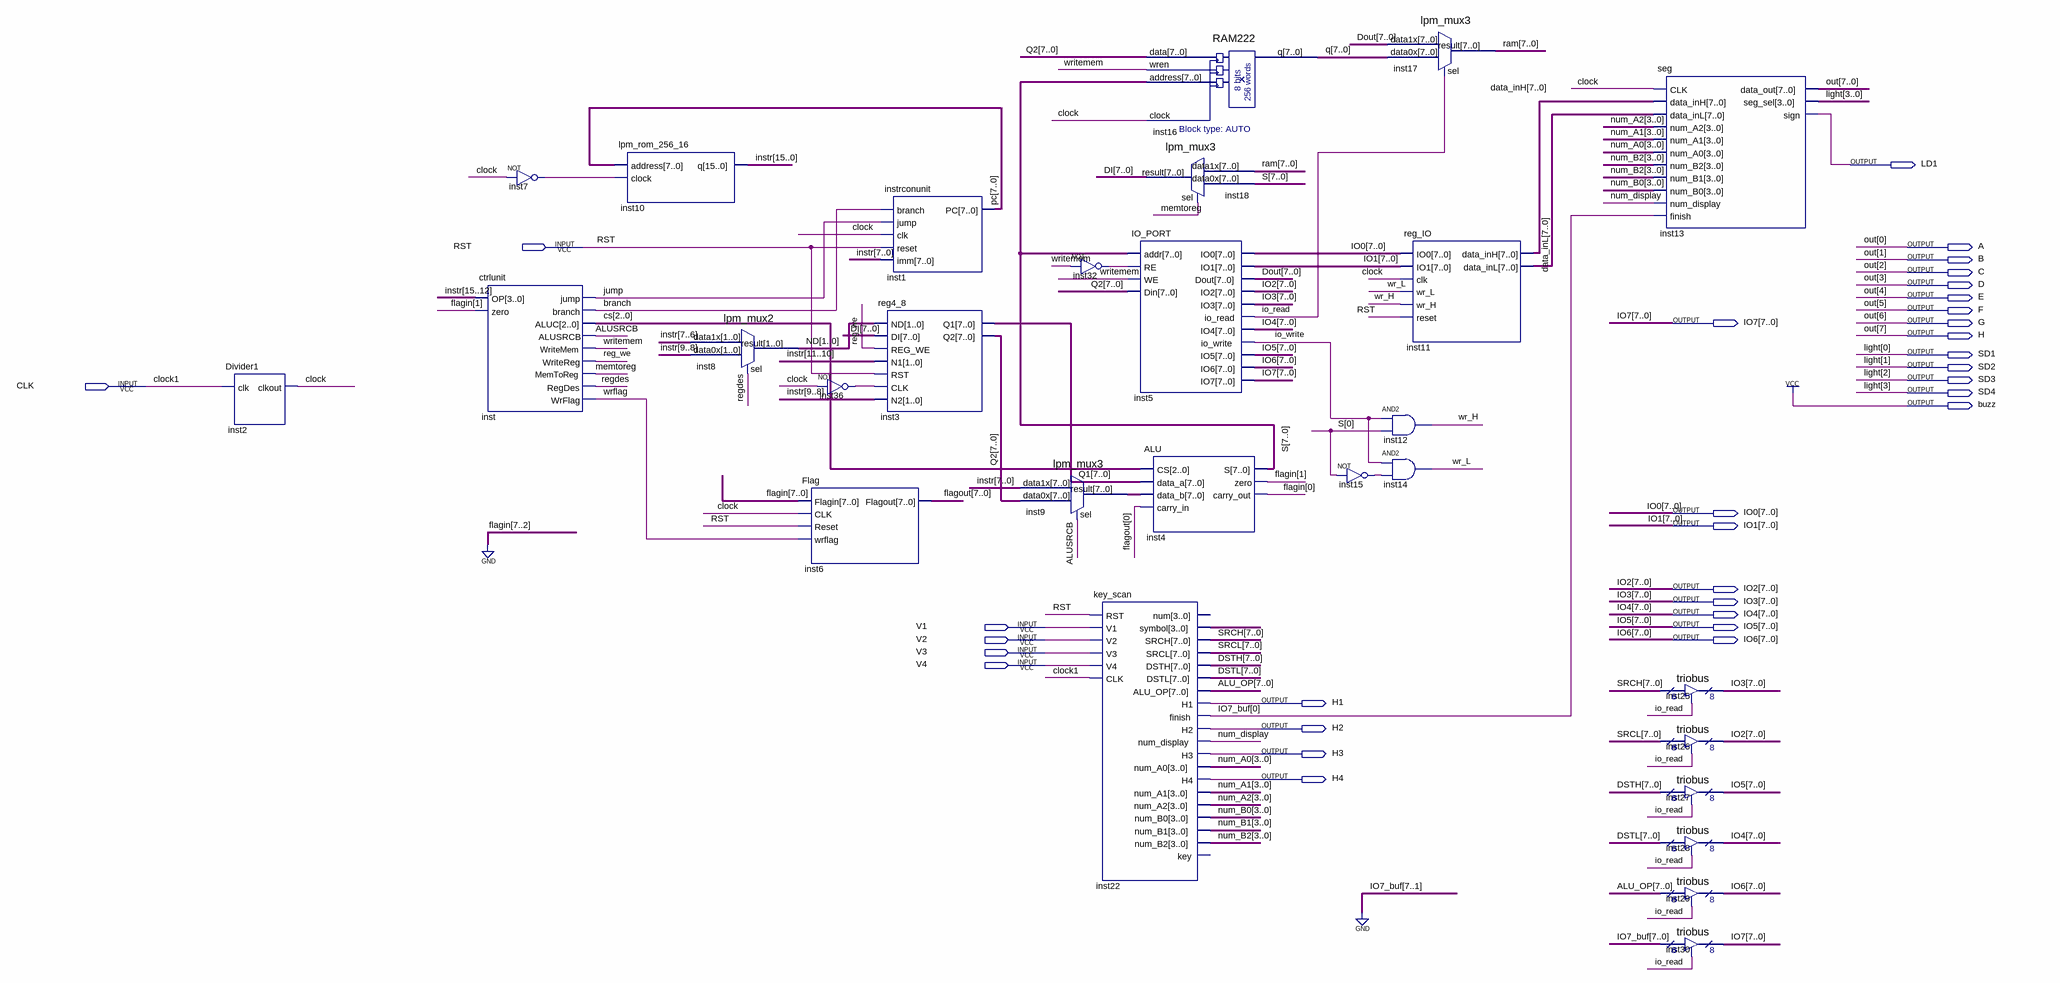
[diagram p0: schematic sheet]
// Quartus schematic systemC.bdf as structural Verilog: 28 symbols, 32 pins
module systemC (
  input  RST,
  input  CLK,
  input  V1,
  input  V2,
  input  V3,
  input  V4,
  output LD1,
  output A,
  output B,
  output C,
  output D,
  output E,
  output F,
  output [7:0] IO7,
  output G,
  output H,
  output SD1,
  output SD2,
  output SD3,
  output SD4,
  output buzz,
  output [7:0] IO0,
  output [7:0] IO1,
  output [7:0] IO2,
  output [7:0] IO3,
  output [7:0] IO4,
  output [7:0] IO5,
  output [7:0] IO6,
  output H1,
  output H2,
  output H3,
  output H4
);

  wire ALUSRCB, branch, clock, inst7_out, inst15_out, inst32_out, inst36_out, io_read, io_write, jump,
       memtoreg, num_display, reg_we, regdes, wr_H, wr_L, wrflag, writemem;
  wire [0:0] IO7_buf;
  wire [1:0] flagin, ND;
  wire [2:0] cs;
  wire [3:0] inst22_symbol, num_A0, num_A1, num_A2, num_B0, num_B1, num_B2;
  wire [7:0] ALU_OP, data_inH, data_inL, DI, Dout, DSTH, DSTL, flagout, inst9_result, pc, q, Q1, Q2, ram, S,
       SRCH, SRCL;
  wire [15:0] instr;

  Divider1 inst2 (.clk(CLK), .clkout(clock));
  not inst7 (inst7_out, clock);
  ctrlunit inst (
    .OP(instr[15:12]), .zero(flagin[1]), .jump(jump), .branch(branch), .ALUC(cs), .ALUSRCB(ALUSRCB),
    .WriteMem(writemem), .WriteReg(reg_we), .MemToReg(memtoreg), .RegDes(regdes), .WrFlag(wrflag));
  lpm_rom_256_16 inst10 (.address(pc), .clock(inst7_out), .q(instr));
  lpm_mux2 inst8 (.data1x(instr[7:6]), .data0x(instr[9:8]), .sel(regdes), .result(ND));
  not inst36 (inst36_out, clock);
  Flag inst6 (.Flagin({{6{1'b0}}, flagin}), .CLK(clock), .Reset(RST), .wrflag(wrflag), .Flagout(flagout));
  reg4_8 inst3 (
    .ND(ND), .DI(DI), .REG_WE(reg_we), .N1(instr[11:10]), .RST(RST), .CLK(inst36_out), .N2(instr[9:8]),
    .Q1(Q1), .Q2(Q2));
  instrconunit inst1 (.branch(branch), .jump(jump), .clk(clock), .reset(RST), .imm(instr[7:0]), .PC(pc));
  lpm_mux3 inst9 (.data1x(instr[7:0]), .data0x(Q2), .sel(ALUSRCB), .result(inst9_result));
  not inst32 (inst32_out, writemem);
  IO_PORT inst5 (
    .addr(S), .RE(inst32_out), .WE(writemem), .Din(Q2), .Dout(Dout), .io_read(io_read), .io_write(io_write),
    .IO0(IO0), .IO1(IO1), .IO2(IO2), .IO3(IO3), .IO4(IO4), .IO5(IO5), .IO6(IO6), .IO7(IO7));
  key_scan inst22 (
    .RST(RST), .V1(V1), .V2(V2), .V3(V3), .V4(V4), .CLK(CLK), .symbol(inst22_symbol), .SRCH(SRCH),
    .SRCL(SRCL), .DSTH(DSTH), .DSTL(DSTL), .ALU_OP(ALU_OP), .H1(H1), .finish(IO7_buf[0]), .H2(H2),
    .num_display(num_display), .H3(H3), .num_A0(num_A0), .H4(H4), .num_A1(num_A1), .num_A2(num_A2),
    .num_B0(num_B0), .num_B1(num_B1), .num_B2(num_B2));  // open: num, key
  RAM222 inst16 (.data(Q2), .wren(writemem), .address(S), .clock(clock), .q(q));
  lpm_mux3 inst18 (.data1x(ram), .data0x(S), .sel(memtoreg), .result(DI));
  ALU inst4 (
    .CS(cs), .data_a(Q1), .data_b(inst9_result), .carry_in(flagout[0]), .S(S), .zero(flagin[1]),
    .carry_out(flagin[0]));
  and inst12 (wr_H, io_write, S[0]);
  and inst14 (wr_L, io_write, inst15_out);
  not inst15 (inst15_out, S[0]);
  lpm_mux3 inst17 (.data1x(Dout), .data0x(q), .sel(io_read), .result(ram));
  reg_IO inst11 (
    .IO0(IO0), .IO1(IO1), .clk(clock), .wr_L(wr_L), .wr_H(wr_H), .reset(RST), .data_inH(data_inH),
    .data_inL(data_inL));
  seg inst13 (
    .CLK(clock), .data_inH(data_inH), .data_inL(data_inL), .num_A2(num_A2), .num_A1(num_A1), .num_A0(num_A0),
    .num_B2(num_B2), .num_B1(num_B2), .num_B0(num_B0), .num_display(num_display), .finish(IO7_buf[0]),
    .data_out({H, G, F, E, D, C, B, A}), .seg_sel({SD4, SD3, SD2, SD1}), .sign(LD1));
  triobus inst25 (.enabledt(io_read), .data(SRCH), .tridata(IO3));
  triobus inst26 (.enabledt(io_read), .data(SRCL), .tridata(IO2));
  triobus inst27 (.enabledt(io_read), .data(DSTH), .tridata(IO5));
  triobus inst28 (.enabledt(io_read), .data(DSTL), .tridata(IO4));
  triobus inst29 (.enabledt(io_read), .data(ALU_OP), .tridata(IO6));
  triobus inst30 (.enabledt(io_read), .data({{7{1'b0}}, IO7_buf[0]}), .tridata(IO7));

  assign buzz = 1'b1;

  // Other names for the same wires on the sheet: clock1 = CLK; light[3:0] = {SD4, SD3, SD2, SD1};
  //   out[7:0] = {H, G, F, E, D, C, B, A}
endmodule
